# EAGLE design gas-sensor-mics-6814-mk-1.1 (EAGLE 7.5.0)
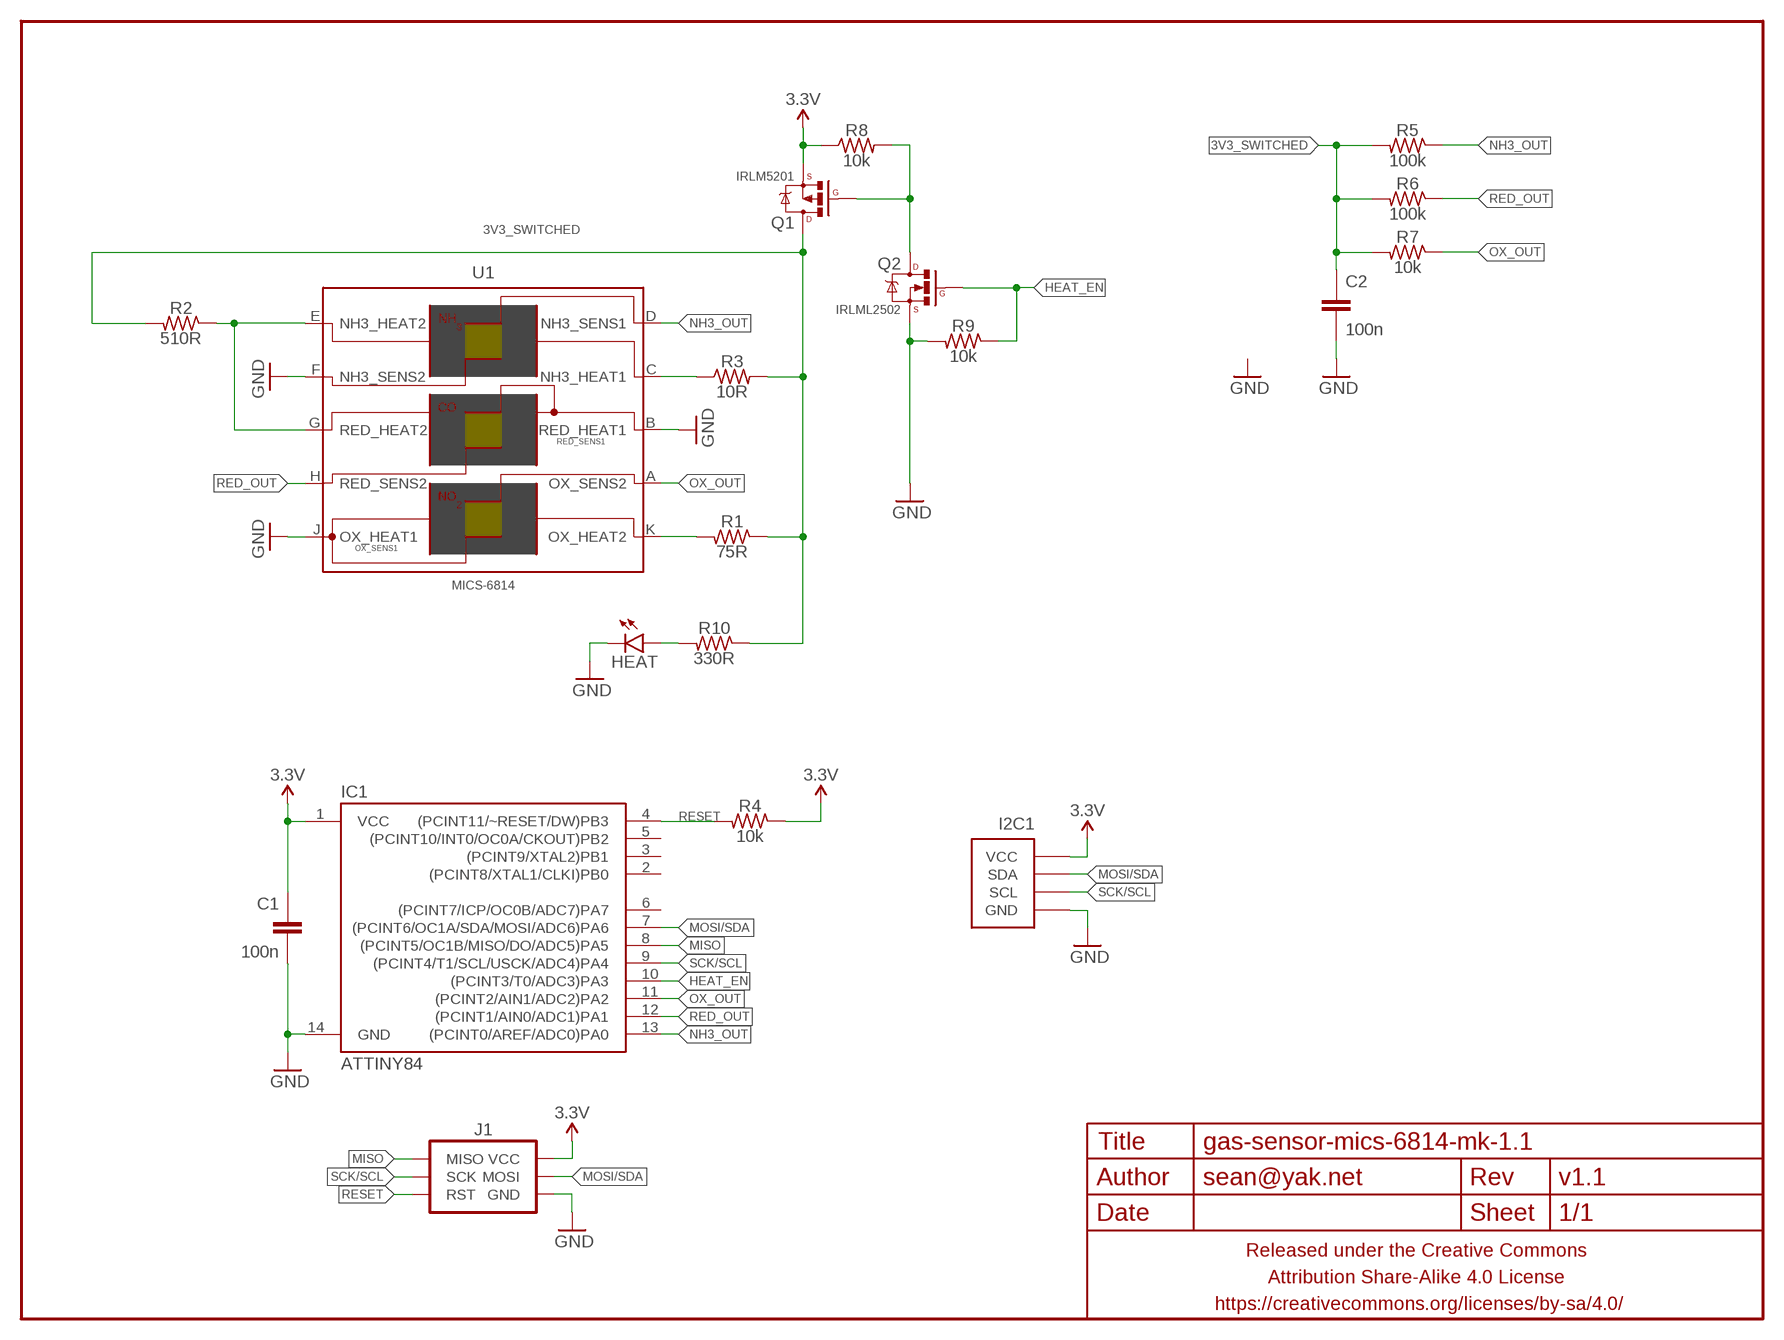
[diagram p0: schematic, sheet 1]

## Parts
C1  100n  CAPACITOR-CERAMICC0603-TIGHTER  [C0603-TIGHTER]
C2  100n  CAPACITOR-CERAMICC0603-TIGHTER  [C0603-TIGHTER]
FRAME1  FRAME-LETTERNO_PACKAGE  [DUMMY]
HEAT  LED0603-TIGHT  [LED-0603-TIGHT]
I2C1  M04-I2CPTH-0.1IN-CENTERED  [1X04-PTH-VERT-I2C-CENTERED]
IC1  ATTINY84  [SO14]
J1  AVR_SPI_PRG_6SMD_TEST_POINTS  [2X3_SMD_TEST_POINTS]
Q1  IRLM5201  MOSFET-PCHANNELSOT-23  [SOT23]
Q2  IRLML2502  MOSFET-NCHANNELIRLML2502  [SOT23]
R1  75R  RESISTORR0603-TIGHTER  [R0603-TIGHTER]
R2  510R  RESISTORR0603-TIGHTER  [R0603-TIGHTER]
R3  10R  RESISTORR0603-TIGHTER  [R0603-TIGHTER]
R4  10k  RESISTORR0603-TIGHTER  [R0603-TIGHTER]
R5  100k  RESISTORR0603-TIGHTER  [R0603-TIGHTER]
R6  100k  RESISTORR0603-TIGHTER  [R0603-TIGHTER]
R7  10k  RESISTORR0603-TIGHTER  [R0603-TIGHTER]
R8  10k  RESISTORR0603-TIGHTER  [R0603-TIGHTER]
R9  10k  RESISTORR0603-TIGHTER  [R0603-TIGHTER]
R10  330R  RESISTORR0603-TIGHTER  [R0603-TIGHTER]
U1  MICS-6814  [MICS-10-PIN]

## Nets
3.3V: C1.1 I2C1.VCC IC1.1(VCC) J1.2(VCC) Q1.2(S) R4.1 R8.1
3V3_SWITCHED: C2.1 Q1.3(D) R1.1 R2.2 R3.2 R5.2 R6.2 R7.2 R10.1
GND: C1.2 C2.2 HEAT.C I2C1.GND IC1.14(GND) J1.6(GND) Q2.2(S) R9.2 U1.B(RED_HEAT1) U1.F(NH3_SENS2) U1.J(OX_HEAT1)
HEAT_EN: IC1.10((PCINT3/T0/ADC3)PA3) Q2.1(G) R9.1
MISO: IC1.8((PCINT5/OC1B/MISO/DO/ADC5)PA5) J1.1(MISO)
MOSI/SDA: I2C1.SDA IC1.7((PCINT6/OC1A/SDA/MOSI/ADC6)PA6) J1.4(MOSI)
N$1: R2.1 U1.E(NH3_HEAT2) U1.G(RED_HEAT2)
N$2: R1.2 U1.K(OX_HEAT2)
N$3: R3.1 U1.C(NH3_HEAT1)
N$4: Q1.1(G) Q2.3(D) R8.2
N$5: HEAT.A R10.2
NH3_OUT: IC1.13((PCINT0/AREF/ADC0)PA0) R5.1 U1.D(NH3_SENS1)
OX_OUT: IC1.11((PCINT2/AIN1/ADC2)PA2) R7.1 U1.A(OX_SENS2)
RED_OUT: IC1.12((PCINT1/AIN0/ADC1)PA1) R6.1 U1.H(RED_SENS2)
RESET: IC1.4((PCINT11/~RESET/DW)PB3) J1.5(RST) R4.2
SCK/SCL: I2C1.SCL IC1.9((PCINT4/T1/SCL/USCK/ADC4)PA4) J1.3(SCK)
Unconnected: IC1.2((PCINT8/XTAL1/CLKI)PB0) IC1.3((PCINT9/XTAL2)PB1) IC1.5((PCINT10/INT0/OC0A/CKOUT)PB2) IC1.6((PCINT7/ICP/OC0B/ADC7)PA7)

## Library data of the parts
C1 C2 = a_parts:CAPACITOR-CERAMIC: CAPACITOR, European symbol
FRAME1 = A_butts:FRAME-LETTER: Schematic Frame Standard 8.5x11 US Letter frame; DESIGNER: sean@yak.net; VERSION: v1.1
HEAT = a_parts:LED: LEDs Standard schematic elements and footprints for 5mm, 3mm, 1206, and 0603 sized LEDs. 5mm - Spark Fun Electronics SKU : COM-00529 (and others)
I2C1 = a_parts:M04-I2C
IC1 = a_parts:ATTINY84: Atmel 14-pin 2/4/8kB flash uC
J1 = a_parts:AVR_SPI_PRG_6: AVR ISP 6 Pin This is the reduced ISP connector for AVR programming. Common on Arduino. This footprint will take up less PCB space and can be used with a 10-pin to 6-pin adapter such as SKU: BOB-08508 **Special note about "TEST_POINT" package. The stop mask is on the top side, so if you want your programming test points to be on the bottom of your board, make sure to place this package on the bottom side of the board. This also ensure that the orientation to program from the bottom side will be correct.
Q1 = a_parts:MOSFET-PCHANNEL: Generic PMOSFET IRLML2244 - TRANS-11153 (SOT-23 -20V -4.3A) (1.Gate 2.Source 3.Drain) FQP27P06 - COM-10349 <http://www.sparkfun.com/products/10349> (TO-220 -60V -27A) (1.Gate 2.Source 3.Drain)
Q2 = a_parts:MOSFET-NCHANNEL: Common NMOSFET Parts MFG P/N Store ID Prod ID FDD8780 TRANS-09984 SI7820DN TRANS-11055 FDS6630A IC-08089 2N7002PW TRANS-11151 FQP30N06L COM-10213 TRANS-10060 BSS123LT1G TRANS-08345 BSS138 TRANS-00830 BS170 2N7000
R1-R10 = a_parts:RESISTOR: RESISTOR, American symbol
U1 = a_parts:MICS-6814

## Board
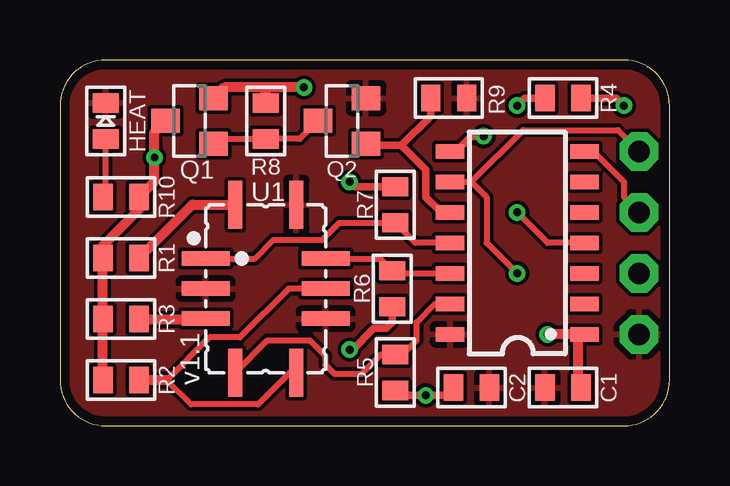
[diagram p1: board, top side]
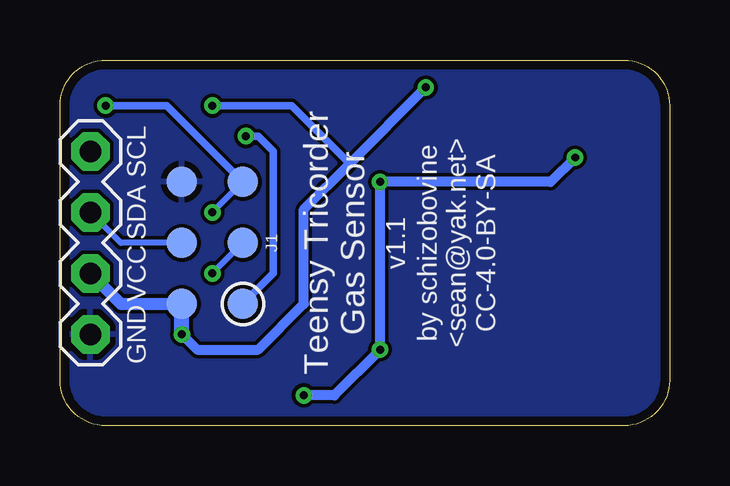
[diagram p2: board, bottom side, seen from below]

Size 25.4 x 15.24 mm. Coordinates in mm from the lower left corner, seen from the top.
Outline: 25.4,1.91 25.4,13.34 arc90 23.5,15.24 1.91,15.24 arc90 0,13.34 0,1.91 arc90 1.91,0 23.5,0 arc90 25.4,1.91
Copper layers (1*16): Top 0.0356mm / dielectric 1.5011mm / Bottom 0.0356mm
Design rules "LaenPCBOrder_2": minimum track width 6mil, minimum drill 13mil, track to track 6mil, track to pad 6mil, pad to pad 6mil, via to via 6mil, smd to smd 6mil, copper to edge 15mil, drill to drill 6mil, minimum pad ring 7mil, minimum via ring 7mil, stop-mask expansion 3mil, vias tented up to drill 20mil, thermal gap 10mil

### Footprints (pad centres in the part's own frame; a part is rotated, then mirrored left to right if it is on the bottom)
C0603-TIGHTER = smd 0.8 x 1.1: 1 -0.75,0; 2 0.75,0
LED-0603-TIGHT = smd 0.8 x 1.1: A 0.75,0; C -0.75,0
1X04-PTH-VERT-I2C-CENTERED = drill 0.9 pad 1.6 octagon: GND -3.81,0; SCL 3.81,0; SDA 1.27,0; VCC -1.27,0
SO14 = smd 0.6 x 1.2: 1 -3.81,-2.8; 2 -2.54,-2.8; 3 -1.27,-2.8; 4 0,-2.8; 5 1.27,-2.8; 6 2.54,-2.8; 7 3.81,-2.8; 8 3.81,2.8; 9 2.54,2.8; 10 1.27,2.8; 11 0,2.8; 12 -1.27,2.8; 13 -2.54,2.8; 14 -3.81,2.8
2X3_SMD_TEST_POINTS = smd 1.27 x 1.27: 1 -2.54,-1.27; 2 -2.54,1.27; 3 0,-1.27; 4 0,1.27; 5 2.54,-1.27; 6 2.54,1.27
SOT23 = smd 1 x 1.2: 1 -0.95,-1; 2 0.95,-1; 3 0,1
R0603-TIGHTER = smd 0.8 x 1.1: 1 -0.75,0; 2 0.75,0
MICS-10-PIN = smd 0.6 x 2: A -1.25,-2.5; B 0,-2.5; C 1.25,-2.5; F 1.25,2.5; G 0,2.5; H -1.25,2.5 | smd 2 x 0.6: D 3.5,-1.27; E 3.5,1.27; J -3.5,1.27; K -3.5,-1.27

### Placement (x,y rotation side)
C1  20.95,1.59 180 top
C2  17.14,1.59 0 top
FRAME1  0,0 0 top
HEAT  1.91,12.7 270 top
I2C1  24.13,7.62 90 bottom
IC1  19.05,7.62 90 top
J1  19.05,7.62 90 bottom
Q1  5.4,12.7 90 top
Q2  11.75,12.7 90 top
R1  2.54,6.99 0 top
R2  2.54,1.91 180 top
R3  2.54,4.45 180 top
R4  20.95,13.65 0 top
R5  13.97,2.22 270 top
R6  13.84,5.71 270 top
R7  13.97,9.21 90 top
R8  8.57,12.7 270 top
R9  16.19,13.65 0 top
R10  2.54,9.53 180 top
U1  8.57,5.71 270 top

### Tracks (layer width: path | path; a pad name or v marks a point on that pad's centre or on a via)
3.3V  (via drill 0.33)
  Top 0.305: R4.1 19.37,13.65 v19.05,13.34
  Top 0.406: IC1.1 21.59,3.81 | 21.59,3.81 v20.32,3.81 | C1.1 21.59,1.7 21.59,3.81 | v10.16,14.1 8.64,14.1 | 8.64,14.1 6.84,14.1 Q1.2 | R8.1 8.57,13.91 8.64,14.1
  Bottom 0.305: v19.05,13.34 15.75,13.34 13.34,10.92
  Bottom 0.406: v20.32,3.81 19.68,3.17 17.14,3.17 15.24,5.08 15.24,9.02 13.34,10.92 v10.16,14.1
  Bottom 0.508: I2C1.VCC 22.86,5.08 J1.2
  Bottom 0.635: v20.32,3.81 J1.2
3V3_SWITCHED  (via drill 0.33)
  Top 0.305: v12.06,10.16 12.27,9.96 R7.2 | R6.2 13.84,4.32 13.59,4.06 13.08,4.06 12.19,3.17 v12.06,3.17 | R5.2 14.17,1.27 v15.24,1.27 16.08,1.27 C2.1
  Top 0.406: R2.2 R3.2 R1.1 1.79,7.5 3.29,9.01 R10.1 3.94,10.17 v3.94,11.18 3.94,12.24 Q1.3
  Bottom 0.406: v3.94,11.18 4.95,10.16 v12.06,10.16 v12.06,3.17 13.97,1.27 v15.24,1.27
GND
  pour Top: 0,13.34 0,1.91 arc90 1.91,0 23.5,0 arc90 25.4,1.91 25.4,13.34 arc90 23.5,15.24 1.91,15.24 arc90
  pour Bottom: 0,13.34 0,1.91 arc90 1.91,0 23.5,0 arc90 25.4,1.91 25.4,13.34 arc90 23.5,15.24 1.91,15.24 arc90
HEAT_EN
  Top 0.305: IC1.10 15.88,8.89 15.24,9.53 15.24,10.67 14.22,11.68 | Q2.1 12.81,11.68 14.22,11.68 | R9.1 15.44,12.9 14.22,11.68
MISO  (via drill 0.33)
  Top 0.305: v17.65,12.06 17.14,12.06 16.57,11.49 16.31,11.49 IC1.8
  Bottom 0.305: J1.1 16.51,6.35 16.51,11.43 17.14,12.06 v17.65,12.06
MOSI/SDA
  Top 0.254: 22.23,11.43 23.5,10.16 23.5,9.53 I2C1.SDA
  Top 0.305: IC1.7 22.23,11.43
  Bottom 0.254: J1.4 22.86,7.62 I2C1.SDA
N$1
  Top 0.254: U1.E 9.58,2.21 8.26,0.89 5.46,0.89 4.45,1.91 6.22,3.68 7.49,3.68 9.53,5.71 U1.G
  Top 0.406: 4.45,1.91 R2.1
N$2
  Top 0.406: R1.2 5.52,9.21 U1.K
N$3
  Top 0.406: R3.1 6.05,4.45 U1.C
N$4
  Top 0.254: Q2.3 10,11.95 R8.2 6.6,11.95 Q1.1
N$5
  Top 0.254: R10.2 1.91,9.64 HEAT.A
NH3_OUT
  Top 0.254: IC1.13 15.62,5.08 14.86,4.32 14.86,3.56 14.28,2.97 R5.1 13.39,2.97 12.57,2.16 11.43,2.16 11.05,2.54 11.05,2.92 10.41,3.56 8.64,3.56 U1.D
OX_OUT
  Top 0.254: IC1.11 14.81,7.62 R7.1 11.63,8.46 10.92,7.75 8.89,7.75 8.11,6.96 U1.A
RED_OUT
  Top 0.254: IC1.12 13.83,6.35 R6.1 13.34,6.96 U1.H
RESET  (via drill 0.33)
  Top 0.254: IC1.4 20.32,7.62 v19.05,8.89
  Top 0.305: v23.5,13.34 23.18,13.65 R4.2
  Bottom 0.254: v19.05,8.89 J1.5
  Bottom 0.305: J1.5 20.95,13.34 v23.5,13.34
SCK/SCL  (via drill 0.33)
  Top 0.254: IC1.9 17.14,10.16 | 17.14,10.16 19.3,12.32 23.24,12.32 I2C1.SCL | 17.14,10.16 17.78,9.53 J1.3 v19.05,6.35
  Bottom 0.254: v19.05,6.35 J1.3

### Text on the board
bPlace: by schizobovine / <sean@yak.net> / CC-4.0-BY-SA | Teensy Tricorder / Gas Sensor